# Altium project Control_Board_2022.PrjPcb
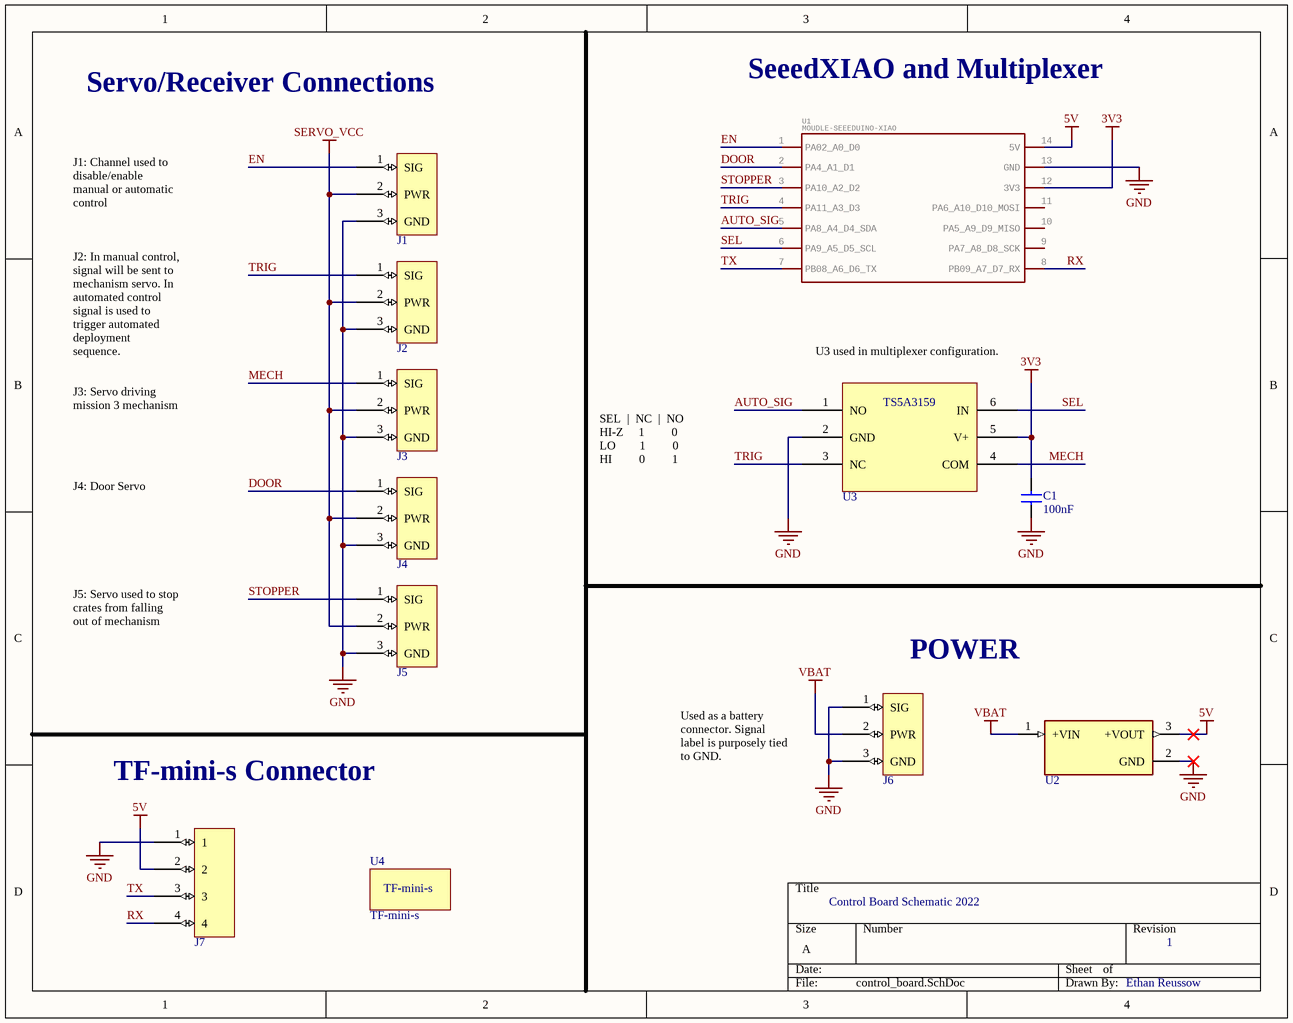
[diagram p0: control_board.SchDoc]
1 sheet, 12 parts. Net scope: global (net labels, ports and power ports of the same name join across sheets).
Board file: control_board.PcbDoc

## Sheet control_board.SchDoc
size A; SheetNumber: 1; SheetTotal: 1

### Parts
C1  value 100nF  [CAPC0603]  (hidden comment: Cap)
J1  3x1 conn  [1x3 2.54MM]  (value not drawn)
J2  3x1 conn  [1x3 2.54MM]  (value not drawn)
J3  3x1 conn  [1x3 2.54MM]  (value not drawn)
J4  3x1 conn  [1x3 2.54MM]  (value not drawn)
J5  3x1 conn  [1x3 2.54MM]  (value not drawn)
J6  3x1 conn  [1x3 2.54MM]  (value not drawn)
J7  4x1 conn  [1x4 2.54mm]  (value not drawn)
U1  MOUDLE-SEEEDUINO-XIAO  [MOUDLE14P-2-54-21X17-8MM]
U2  TSR1-2450  [CONV_TSR1-2450]  (value not drawn)
U3  TS5A3159DBVR  [SOT23-6]  (value not drawn)
U4  TF-mini-s  [TF-mini-s]

### Nets
3V3: C1.1(A) U1.12(3V3) U3.5(V+)
5V: J7.2 U1.14(5V) U2.3(+VOUT)
GND: C1.2(B) J1.3(GND) J2.3(GND) J3.3(GND) J4.3(GND) J5.3(GND) J6.1(SIG) J6.3(GND) J7.1 U1.13(GND) U2.2(GND) U3.2(GND)
SERVO_VCC: J1.2(PWR) J2.2(PWR) J3.2(PWR) J4.2(PWR) J5.2(PWR)
VBAT: J6.2(PWR) U2.1(+VIN)
AUTO_SIG: U1.5(PA8_A4_D4_SDA) U3.1(NO)
DOOR: J4.1(SIG) U1.2(PA4_A1_D1)
EN: J1.1(SIG) U1.1(PA02_A0_D0)
MECH: J3.1(SIG) U3.4(COM)
RX: J7.4 U1.8(PB09_A7_D7_RX)
SEL: U1.6(PA9_A5_D5_SCL) U3.6(IN)
STOPPER: J5.1(SIG) U1.3(PA10_A2_D2)
TRIG: J2.1(SIG) U1.4(PA11_A3_D3) U3.3(NC)
TX: J7.3 U1.7(PB08_A6_D6_TX)

Not connected (* = marked no-connect by the designer): U1 9(PA7_A8_D8_SCK) 10(PA5_A9_D9_MISO) 11(PA6_A10_D10_MOSI)

### Notes on the sheet
- Servo/Receiver Connections
- SeeedXIAO and Multiplexer
- J1: Channel used to disable/enable manual or automatic control
- J2: In manual control, signal will be sent to mechanism servo. In automated control signal is used to trigger automated deployment sequence.
- U3 used in multiplexer configuration.
- J3: Servo driving mission 3 mechanism
- SEL  |  NC  |  NO
  HI-Z     1         0
  LO        1         0
  HI         0         1
- J4: Door Servo
- J5: Servo used to stop crates from falling out of mechanism
- (near J6) POWER
- Used as a battery connector. Signal label is purposely tied to GND.
- TF-mini-s Connector
- Control Board Schematic 2022
- 1
- Ethan Reussow
- (in symbol TS5A3159DBVR) TS5A3159

### Library data of the parts
J1-J6 = 3x1 conn: Pinout for a servo connector
U1 = MOUDLE-SEEEDUINO-XIAO: GateName_1: G$1; SymbolName_1: MOUDLE-SEEEDUINO-XIAO; LibraryName: Seeeduino XIAO; DeviceSetName: MOUDLE-SEEEDUINO-XIAO; Package: MOUDLE14P-2.54-21X17.8MM
U2 = TSR1-2450: Non-Isolated PoL Module DC DC Converter 1 Output 5V 1A 7V - 36V Input; MF: Traco Power; Price: None; Package: SIP-3 Tracopower; Check_prices: https://www.snapeda.com/parts/TSR%201-2450/Traco%20Power/view-part/5846336/?ref=eda; Availability: Warning; MP: TSR 1-2450; Value: *; Purchase-URL: https://pricing.snapeda.com/search/part/TSR 1-2450/?ref=eda; SnapEDA_Link: https://www.snapeda.com/parts/TSR%201-2450/Traco%20Power/view-part/5846336/?ref=snap
C1 = Cap: Supplier 1: Digi-Key; Supplier Part Number 1: 1276-1000-1-ND